# EAGLE design sch+®ma_carte_alim_v1_1 (EAGLE 6.5.0)

## Sheet 1 of 2
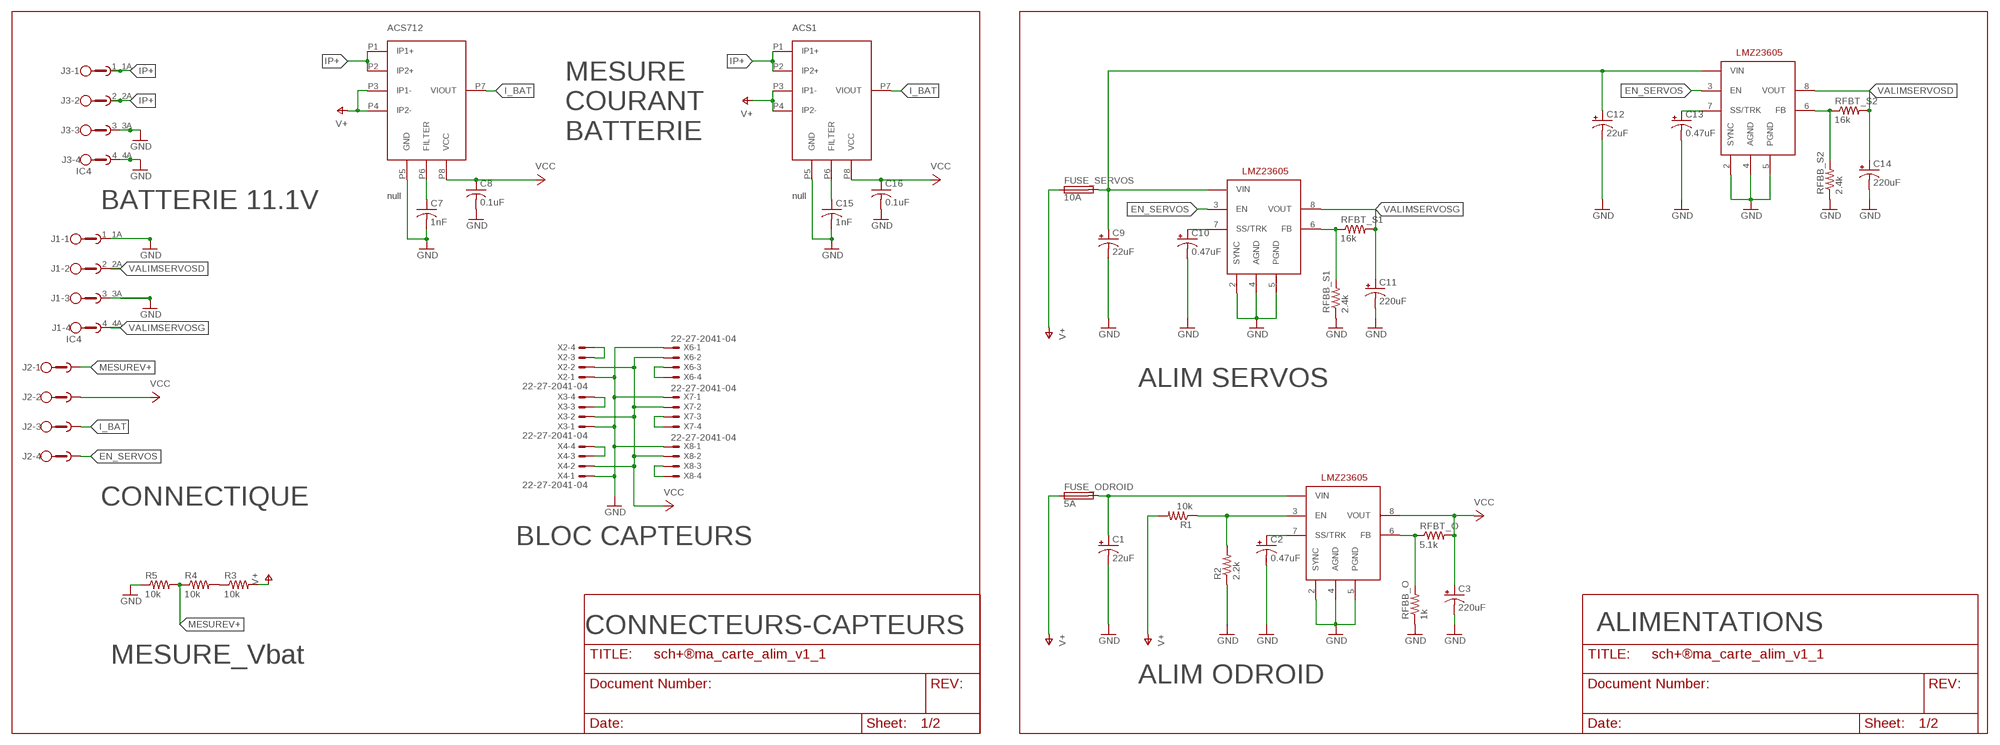
[diagram p0: schematic, sheet 1]

### Parts
ACS1  null  ACS712  [ACS712]
ACS712  null  ACS712  [ACS712]
ALIM_ODROID  LMZ23605  [LMZ23605]
ALIM_SERVOS1  LMZ23605  [LMZ23605]
ALIM_SERVOS2  LMZ23605  [LMZ23605]
C1  22uF  CPOL-USE2.5-6  [E2,5-6]
C2  0.47uF  CPOL-USE2-5  [E2-5]
C3  220uF  CPOL-USE3.5-8  [E3,5-8]
C7  1nF  C-USC0805  [C0805]
C8  0.1uF  C-USC0805  [C0805]
C9  22uF  CPOL-USE2.5-6  [E2,5-6]
C10  0.47uF  CPOL-USE2-5  [E2-5]
C11  220uF  CPOL-USE3.5-8  [E3,5-8]
C12  22uF  CPOL-USE2.5-6  [E2,5-6]
C13  0.47uF  CPOL-USE2-5  [E2-5]
C14  220uF  CPOL-USE3.5-8  [E3,5-8]
C15  1nF  C-USC0805  [C0805]
C16  0.1uF  C-USC0805  [C0805]
FUSE_ODROID  5A  SH22,5  [SH22,5]
FUSE_SERVOS  10A  SH22,5  [SH22,5]
J1  IC4  [IC4]
J2  MC1.5/4-G-3.81  [MC1.5/4-G-3.81]
J3  IC4  [IC4]
R1  10k  R-US_R0805  [R0805]
R2  2.2k  R-US_R0805  [R0805]
R3  10k  R-US_M0805  [M0805]
R4  10k  R-US_M0805  [M0805]
R5  10k  R-US_M0805  [M0805]
RFBB_O  1k  R-US_R0805  [R0805]
RFBB_S1  2.4k  R-US_R0805  [R0805]
RFBB_S2  2.4k  R-US_R0805  [R0805]
RFBT_O  5.1k  R-US_R0805  [R0805]
RFBT_S1  16k  R-US_R0805  [R0805]
RFBT_S2  16k  R-US_R0805  [R0805]
X2  22-27-2041-04  [6410-04]
X3  22-27-2041-04  [6410-04]
X4  22-27-2041-04  [6410-04]
X6  22-27-2041-04  [6410-04]
X7  22-27-2041-04  [6410-04]
X8  22-27-2041-04  [6410-04]

### Nets
EN_SERVOS [4A_ODROI]: ALIM_SERVOS1.3(EN) ALIM_SERVOS2.3(EN) J2.4
GND [1A_CAPTEURS+fil_fable_courant]: ACS1.P5(GND) ACS712.P5(GND) ALIM_ODROID.2(SYNC) ALIM_ODROID.4(AGND) ALIM_ODROID.5(PGND) ALIM_SERVOS1.2(SYNC) ALIM_SERVOS1.4(AGND) ALIM_SERVOS1.5(PGND) ALIM_SERVOS2.2(SYNC) ALIM_SERVOS2.4(AGND) ALIM_SERVOS2.5(PGND) C1.- C2.- C3.- C7.2 C8.2 C9.- C10.- C11.- C12.- C13.- C14.- C15.2 C16.2 J1.1 J1.1A J1.3 J1.3A J3.3 J3.3A J3.4 J3.4A R2.1 R5.1 RFBB_O.1 RFBB_S1.1 RFBB_S2.1 X2.1 X3.1 X4.1 X6.1 X7.1 X8.1
I_BAT [1A_CAPTEURS+fil_fable_courant]: ACS1.P7(VIOUT) ACS712.P7(VIOUT) J2.3
IP+: ACS1.P1(IP1+) ACS1.P2(IP2+) ACS712.P1(IP1+) ACS712.P2(IP2+) J3.1 J3.1A J3.2 J3.2A
MESUREV+ [1A_CAPTEURS+fil_fable_courant]: J2.1 R4.1 R5.2
N$1: X6.3 X6.4
N$2 [4A_ODROI]: ALIM_ODROID.7(SS/TRK) C2.+
N$4 [1A_CAPTEURS+fil_fable_courant]: ALIM_ODROID.6(FB) RFBB_O.2 RFBT_O.1
N$5 [1A_CAPTEURS+fil_fable_courant]: R3.1 R4.2
N$6 [1A_CAPTEURS+fil_fable_courant]: ACS1.P6(FILTER) C15.1
N$7: X7.3 X7.4
N$8 [1A_CAPTEURS+fil_fable_courant]: ALIM_ODROID.3(EN) R1.1 R2.2
N$9: X8.3 X8.4
N$11 [1A_CAPTEURS+fil_fable_courant]: ACS712.P6(FILTER) C7.1
N$19 [4A_ODROI]: ALIM_SERVOS1.7(SS/TRK) C10.+
N$22 [1A_CAPTEURS+fil_fable_courant]: X2.3 X2.4
N$25 [1A_CAPTEURS+fil_fable_courant]: X3.3 X3.4
N$26 [1A_CAPTEURS+fil_fable_courant]: X4.3 X4.4
N$28 [1A_CAPTEURS+fil_fable_courant]: ALIM_SERVOS1.6(FB) RFBB_S1.2 RFBT_S1.1
N$31 [4A_ODROI]: ALIM_SERVOS2.7(SS/TRK) C13.+
N$32 [1A_CAPTEURS+fil_fable_courant]: ALIM_SERVOS2.6(FB) RFBB_S2.2 RFBT_S2.1
V+ [1A_CAPTEURS+fil_fable_courant]: ACS1.P3(IP1-) ACS1.P4(IP2-) ACS712.P3(IP1-) ACS712.P4(IP2-) FUSE_ODROID.1 FUSE_SERVOS.1 R1.2 R3.2
VALIMSERVOSD [10A_SERVOS]: ALIM_SERVOS2.8(VOUT) C14.+ J1.2 J1.2A RFBT_S2.2
VALIMSERVOSG [10A_SERVOS]: ALIM_SERVOS1.8(VOUT) C11.+ J1.4 J1.4A RFBT_S1.2
VCC [4A_ODROI]: ACS1.P8(VCC) ACS712.P8(VCC) ALIM_ODROID.8(VOUT) C3.+ C8.1 C16.1 J2.2 RFBT_O.2 X2.2 X3.2 X4.2 X6.2 X7.2 X8.2
VIN [10A_SERVOS]: ALIM_SERVOS1.1(VIN) ALIM_SERVOS2.1(VIN) C9.+ C12.+ FUSE_SERVOS.2
VINO [5A_LMZ_SERVOS]: ALIM_ODROID.1(VIN) C1.+ FUSE_ODROID.2

### Notes on the sheet
- MESURE
  COURANT
  BATTERIE
- BATTERIE 11.1V
- ALIM SERVOS
- CONNECTIQUE
- BLOC CAPTEURS
- CONNECTEURS-CAPTEURS | ALIMENTATIONS
- MESURE_Vbat
- ALIM ODROID

## Sheet 2 of 2

## Library data of the parts
ACS1 ACS712 = ACS712:ACS712: http://www.allegromicro.com/~/media/Files/Datasheets/ACS712-Datasheet.ashx
ALIM_ODROID ALIM_SERVOS1 ALIM_SERVOS2 = LMZ23605:LMZ23605: LMZ23605 5A SIMPLE SWITCHER® Power Module with 36V Maximum Input Voltage
C1-C3 C9-C14 = rcl:CPOL-US: POLARIZED CAPACITOR, American symbol
C7 C8 C15 C16 = rcl:C-US: CAPACITOR, American symbol
FUSE_ODROID FUSE_SERVOS = fuse:SH22,5: FUSE HOLDER grid 22,5 mm, OGN0031 8201, Schurter (Buerklin); MF: SCHURTER; MPN: 0031.8201; OC_FARNELL: 1162740; OC_NEWARK: 96F8317
J1 J3 = con-phoenix-508:IC4: PHOENIX; OC_FARNELL: unknown; OC_NEWARK: unknown
J2 = Connecteurs_Introlab:MC1.5/4-G-3.81: Digi-Key Part Number 277-1208-ND Manufacturer Part Number 1803293 Description CONN HEADER RT ANG 4POS 3.81MM Goes with Digi-Key Part Number 277-1163-ND Manufacturer Part Number 1803594 Description CONN TERMBLOCK PLUG 4POS 3.81MM
R1-R5 RFBB_O RFBB_S1 RFBB_S2 RFBT_O RFBT_S1 RFBT_S2 = resistor:R-US_: RESISTOR, American symbol
X2-X4 X6-X8 = con-molex:22-?-04: CONNECTOR wire to board 2.54 mm (.1 inch) pitch header; OC_FARNELL: unknown; OC_NEWARK: unknown

## Net classes
0 18A_SORTIE_BATTERIE: width 10.16 mm, clearance 0.008 mm
1 10A_SERVOS: width 5.08 mm, clearance 0.008 mm
2 5A_LMZ_SERVOS: width 1.524 mm
3 4A_ODROI: width 1.524 mm
4 1A_CAPTEURS+fil_fable_courant: width 0.508 mm

## Board
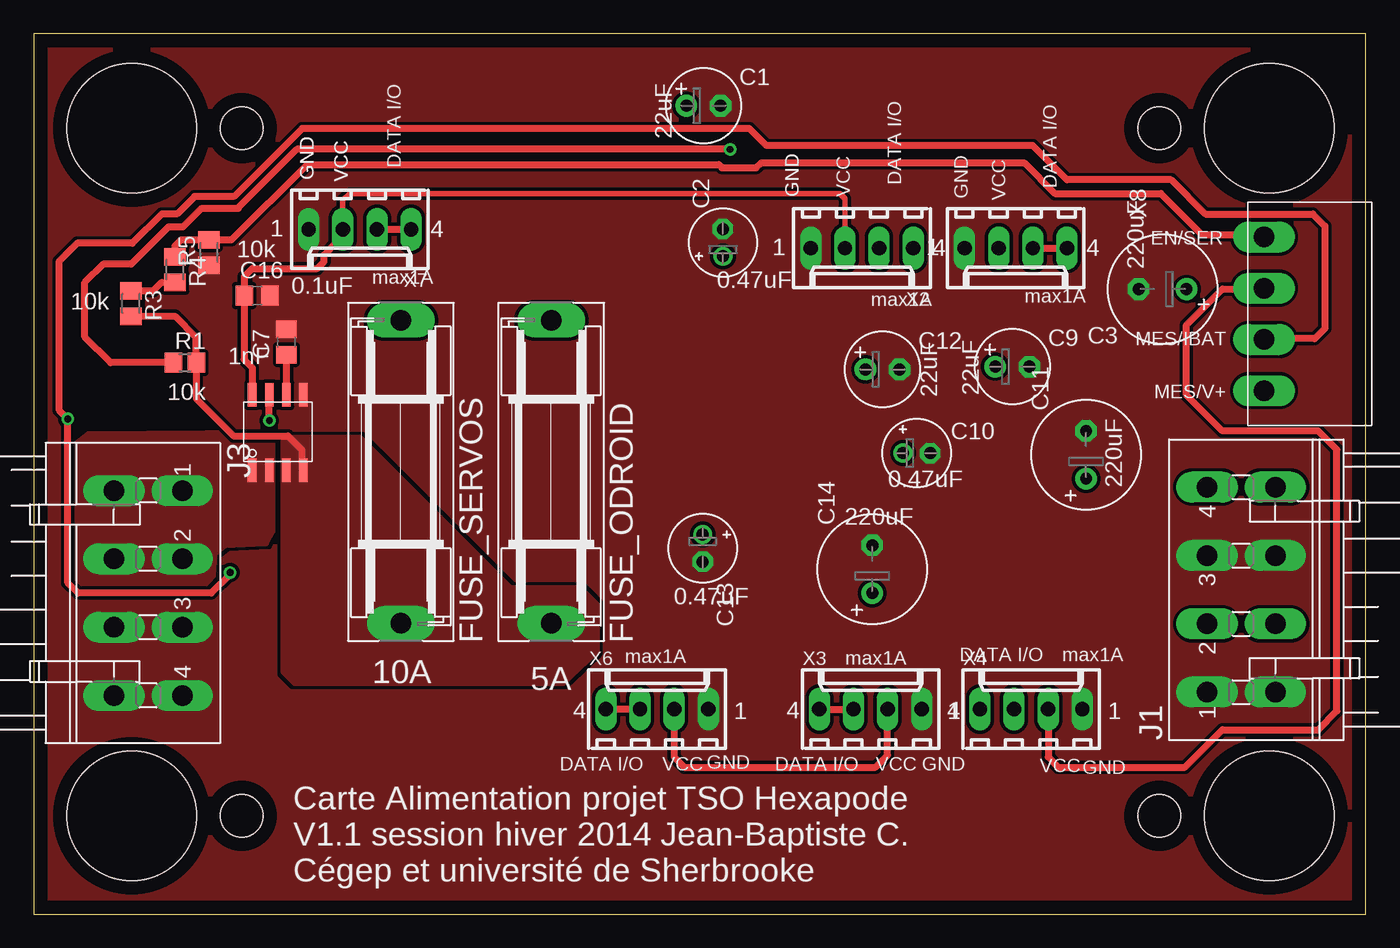
[diagram p1: board, top side]
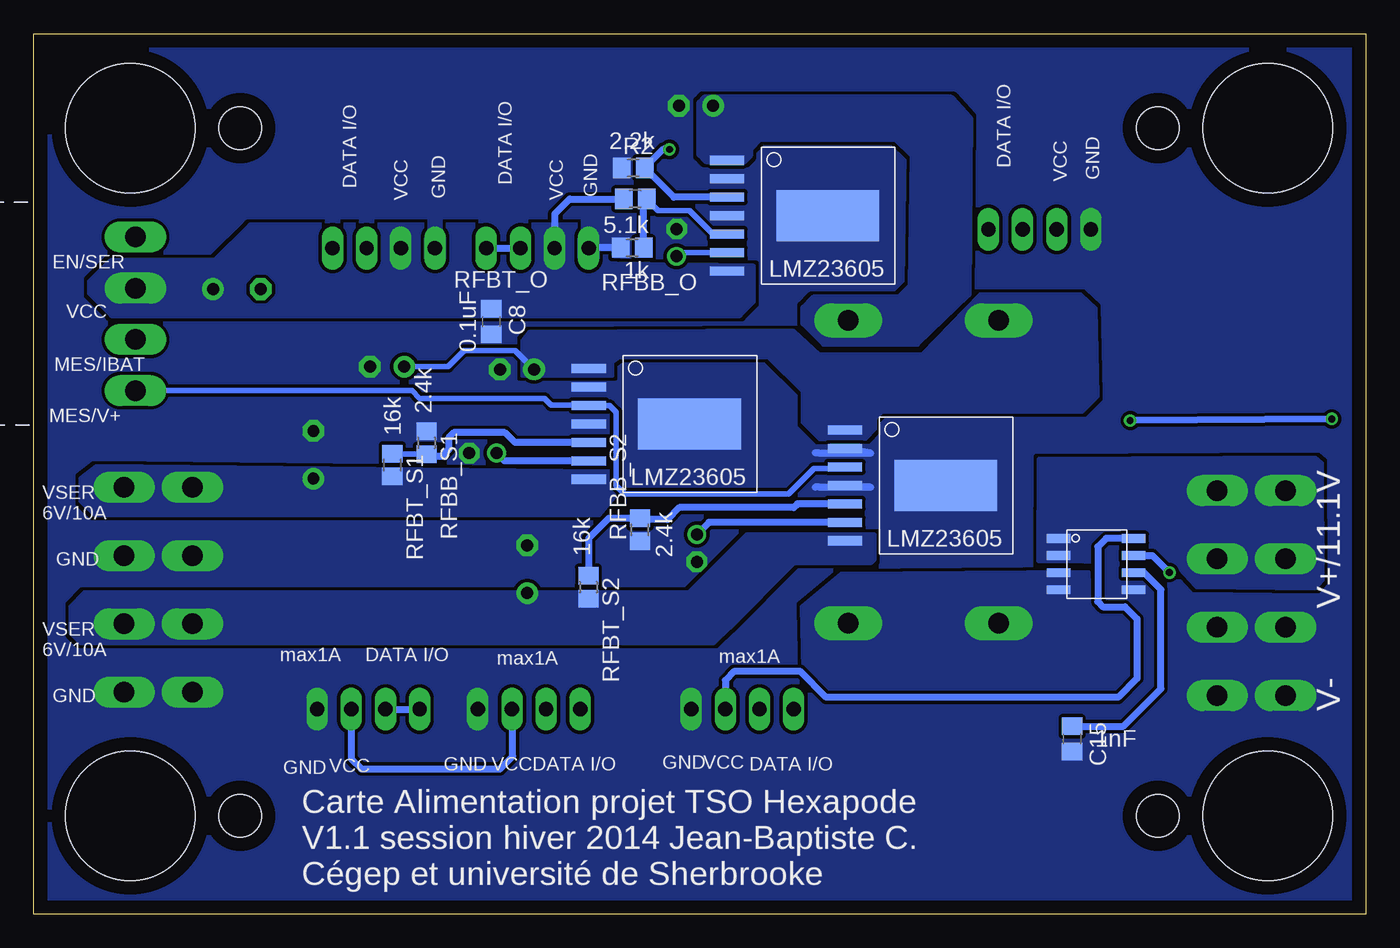
[diagram p2: board, bottom side, seen from below]

Size 99.06 x 65.48 mm. Coordinates in mm from the lower left corner, seen from the top.
Outline: 0,0 99.06,0 99.06,65.48 0,65.48 0,0
Copper layers (1*16): Top 0.035mm / dielectric 1.5mm / Bottom 0.035mm
Design rules "default *": minimum track width 10mil, minimum drill 20mil, track to track 10mil, track to pad 10mil, pad to pad 10mil, via to via 10mil, smd to smd 8mil, copper to edge 40mil, drill to drill 10mil, minimum pad ring 10mil, minimum via ring 8mil, stop-mask expansion 4mil, vias tented up to drill 0mil, thermal gap 0mil
Holes 9.65 mm at 7.3,58.46 7.3,7.3 91.87,58.46 91.87,7.3
Holes 3.17 mm at 15.46,58.46 15.46,7.3 83.72,58.46 83.72,7.3

### Footprints (pad centres in the part's own frame; a part is rotated, then mirrored left to right if it is on the bottom)
ACS712 = smd 0.65 x 1.75: P1 0,0; P2 1.27,0; P3 2.54,0; P4 3.81,0; P5 3.81,5.6; P6 2.54,5.6; P7 1.27,5.6; P8 0,5.6
LMZ23605 = smd 2.54 x 0.686: 1 4.445,11.227; 2 4.445,9.855; 3 4.445,8.484; 4 4.445,7.112; 6 4.445,5.74; 7 4.445,4.369; 8 4.445,2.997 | smd 7.62 x 3.81: 5 11.938,7.112
E2,5-6 = drill 0.889 pad 1.6: + -1.27,0 | drill 0.889 pad 1.6 octagon: - 1.27,0
E2-5 = drill 0.889 pad 1.27: + -1.016,0 | drill 0.889 pad 1.524 octagon: - 1.016,0
E3,5-8 = drill 0.889 pad 1.6: + -1.778,0 | drill 0.889 pad 1.6 octagon: - 1.778,0
C0805 = smd 1.3 x 1.5: 1 -0.95,0; 2 0.95,0
SH22,5 = drill 1.524 pad 2.54 long: 1 -11.252,0; 2 11.252,0
IC4 = drill 1.524 long: 1 -7.62,2.54; 1A -7.62,-2.54; 2 -2.54,2.54; 2A -2.54,-2.54; 3 2.54,2.54; 3A 2.54,-2.54; 4 7.62,2.54; 4A 7.62,-2.54
MC1.5/4-G-3.81 = drill 1.524 pad 2.184 long: 1 2.6,1.2; 2 6.41,1.2; 3 10.22,1.2; 4 14.03,1.2
R0805 = smd 1.3 x 1.5: 1 -0.85,0; 2 0.85,0
M0805 = smd 1.3 x 1.6: 1 -0.95,0; 2 0.95,0
6410-04 = drill 1.067 long: 1 3.81,0; 2 1.27,0; 3 -1.27,0; 4 -3.81,0

### Placement (x,y rotation side)
ACS1  22.86,27.94 270 bottom
ACS712  16.26,33.02 0 top
ALIM_ODROID  51.94,44.83 0 bottom
ALIM_SERVOS1  62.23,29.34 0 bottom
ALIM_SERVOS2  43.18,24.77 0 bottom
C1  49.81,60.12 0 top
C2  51.26,49.94 90 top
C3  83.95,46.48 180 top
C7  18.8,42.55 90 top
C8  65.02,44.07 270 bottom
C9  72.77,40.72 0 top
C10  65.66,34.29 0 top
C11  78.26,34.16 90 top
C12  63.12,40.51 0 top
C13  49.75,27.21 270 top
C14  62.36,25.65 90 top
C15  21.84,13.03 270 bottom
C16  16.61,46 0 top
FUSE_ODROID  38.48,32.89 90 top
FUSE_SERVOS  27.3,32.89 90 top
J1  89.79,24.13 90 top
J2  90.3,52.96 270 top
J3  8.51,23.88 270 top
R1  11.25,41.01 0 top
R2  54.48,55.5 0 bottom
R3  7.24,45.42 270 top
R4  10.52,47.93 270 top
R5  13.03,49.2 90 top
RFBB_O  54.56,49.56 0 bottom
RFBB_S1  69.85,35.05 270 bottom
RFBB_S2  53.98,28.57 90 bottom
RFBT_O  54.33,53.19 180 bottom
RFBT_S1  72.39,33.4 270 bottom
RFBT_S2  57.81,24.31 270 bottom
X2  61.59,49.53 180 top
X3  62.23,15.24 0 top
X4  74.17,15.24 0 top
X6  46.35,15.24 0 top
X7  24.26,50.93 180 top
X8  73.03,49.53 180 top

### Tracks (layer width: path | path; a pad name or v marks a point on that pad's centre or on a via)
EN_SERVOS
  Bottom 0.406: J2.4 70.93,38.93 70.36,38.35 61.09,38.35 60.58,37.85 57.81,37.85 ALIM_SERVOS1.3 56.24,37.82 55.75,37.34 55.75,31.88 55.12,31.24 42.93,31.24 41.02,33.15 38.84,33.15 ALIM_SERVOS2.3
GND
  Bottom 0.508: ALIM_SERVOS2.4 36.83,31.75 40.64,31.75 40.96,31.75 | ALIM_SERVOS2.2 36.83,34.29 40.64,34.29 40.94,34.29 | RFBB_O.1 57.76,49.55 X2.1
  pour Top (rank 2, no thermals): -1.91,67.31 -2.54,-3.3 100.97,-2.54 100.97,67.31
  pour Bottom (rank 2, no thermals): 101.6,67.94 101.6,-3.17 -2.44,-3.4 -2.57,67.89
I_BAT  (via drill 0.51)
  Top 0.508: v17.53,36.7 ACS712.P7 | J2.3 91.56,42.8 95.25,42.8 96.01,43.56 96.01,51.18 95.12,52.07 87.12,52.07 84.58,54.61 76.83,54.61 74.3,57.15 54.48,57.15 53.21,58.42 19.96,58.42 14.91,53.37 11.96,53.37 10.67,52.07 9.53,52.07 7.34,49.89 3.23,49.89 1.91,48.56 1.91,37.47 v2.54,36.83 2.54,24.64 3.3,23.88 13.21,23.88 14.61,25.27 v14.61,25.4
  Bottom 0.508: v2.54,36.83 v17.53,36.7 | ACS1.P7 15.88,26.67 v14.61,25.4
IP+
  pour Top (isolate 0.254, no thermals): 3.05,34.92 4.06,35.69 17.12,35.81 17.78,35.51 17.78,28.45 17.27,27.56 14.22,27.43 13.46,26.8 13.34,25.15 12.62,24.33 2.79,24.33
  pour Bottom (no thermals): 14.25,26.19 24.31,26.31 24.28,33.81 3.78,33.93 3.3,33.53 3.28,24.84 3.81,24.26 12.57,24.38
MESUREV+
  Top 0.508: R4.1 10.52,49.71 10.96,50.15 R5.2 14.72,50.15 20.32,55.75 50.93,55.75 51.18,55.5 53.72,55.5 54.1,55.88 73.66,55.88 75.95,53.59 83.82,53.59 86.87,50.55 91.31,50.55 J2.1
N$1
  Top 0.508: X6.3 X6.4
N$2
  Bottom 0.406: ALIM_ODROID.7 50.88,49.2 C2.+
N$4
  Bottom 0.406: ALIM_ODROID.6 48.54,50.57 50.29,52.32 52.62,52.32 RFBT_O.1
  Bottom 0.508: RFBB_O.2 53.71,52.96 RFBT_O.1
N$5
  Top 0.508: R3.1 8.6,46.35 8.89,46.35 9.53,46.99 R4.2
N$6
  Bottom 0.508: C15.1 18.02,13.98 15.24,16.76 15.24,24.13 16.51,25.4 ACS1.P6
N$7
  Top 0.508: X7.3 X7.4
N$8  (via drill 0.51)
  Top 0.508: v51.79,56.87 19.56,56.87 15.21,52.53 15.21,52.5 12.5,52.5 11.1,51.1 10.01,51.1 7.24,48.34 5.16,48.34 3.81,46.99 3.81,42.93 5.73,41.01 R1.1
  Bottom 0.508: 52.22,56.87 v51.79,56.87 52.26,56.87 R2.2 51.45,53.31 ALIM_ODROID.3
N$9
  Top 0.508: X8.3 X8.4
N$11
  Top 0.508: ACS712.P6 C7.1
N$19
  Bottom 0.508: ALIM_SERVOS1.7 64.06,33.71 C10.+
N$22
  Bottom 0.508: X2.4 X2.3
N$25
  Top 0.508: X3.4 X3.3
N$26
  Bottom 0.508: X4.3 X4.4
N$28
  Bottom 0.406: RFBB_S1.2 72.34,34.2 RFBT_S1.1
  Bottom 0.508: ALIM_SERVOS1.6 63.27,35.08 64.01,35.81 67.82,35.81 68.2,35.43 68.2,34.54 68.71,34.04 69.68,34.04 RFBB_S1.2
N$31
  Bottom 0.508: ALIM_SERVOS2.7 48.84,29.13 C13.+
N$32
  Bottom 0.508: ALIM_SERVOS2.6 42.27,30.5 42.55,30.23 51.05,30.23 51.94,29.34 53.89,29.34 RFBB_S2.2 56.3,29.43 57.78,27.94 57.78,25.18 RFBT_S2.1
V+
  Top 0.508: ACS712.P4 19.94,33.15 19.94,34.54 18.92,35.56 14.86,35.56 12.09,38.33 R1.2 12.06,41.05 12.06,42.93 10.53,44.47 R3.2
  pour Top (no thermals): 41.78,19.43 39.37,17.14 19.43,17.14 18.54,18.03 18.54,35.43 24.26,35.43 35.43,24.26 40.64,24.26 41.91,22.99 41.91,19.56
  pour Bottom: 40.64,16.76 18.67,16.51 17.4,17.4 17.4,21.97 18.03,22.61 20.57,22.76 20.68,25.4 38.99,25.27 41.91,22.86 41.78,18.16
VALIMSERVOSD
  pour Bottom: 40.26,27.81 37.08,27.56 37.34,27.81
  pour Bottom (no thermals): 36.58,28.19 36.58,26.42 36.83,26.16 42.55,26.16 47.37,21.34 48.51,20.19 95.5,20.19 96.27,20.95 96.27,22.86 95.25,23.88 50.29,23.88 45.97,28.19
VALIMSERVOSG
  pour Bottom (no thermals): 55.75,32.38 55.75,31.24 57.02,29.72 94.49,29.72 95.5,30.73 95.5,32.38 94.36,33.27 56.26,32.89
VCC
  Top 0.406: X7.2 22.99,53.09 23.5,53.59 59.94,53.59 60.33,53.21 X2.2
  Top 0.508: 22.86,50.8 X7.2 22.61,50.55 22.61,50.04 21.59,49.02 21.59,48.51 21.08,48.01 16.26,48.01 15.66,47.41 C16.1 15.65,45.98 15.65,41.25 16.26,40.64 ACS712.P8 | X6.2 47.62,11.68 48.39,10.92 62.61,10.92 63.5,11.81 X3.2 | X4.2 75.44,11.68 76.2,10.92 85.6,10.92 88.39,13.72 95.5,13.72 96.9,15.11 96.9,34.54 95.5,35.94 88.39,35.94 85.72,38.61 85.72,43.81 88.39,46.48 91.43,46.48 J2.2
  Bottom 0.508: 22.86,50.8 X7.2 | X2.2 60.33,52.07 59.21,53.19 RFBT_O.2 | X4.2 75.44,11.56 74.68,10.79 64.39,10.79 63.44,11.75 63.44,15.18 X3.2 | ACS1.P8 19.3,27.94 19.94,27.3 19.94,23.24 19.56,22.86 17.91,22.86 17.02,21.97 17.02,17.53 18.41,16.13 40.13,16.13 42.04,18.03 46.99,18.03 47.62,17.4 X6.2
  pour Bottom (no thermals): 45.59,48.13 55.75,48.26 58.55,51.18 82.93,51.18 85.6,48.51 93.34,48.51 94.87,46.99 94.87,46.23 93.22,44.58 46.61,44.58 45.59,45.59
VIN
  Bottom 0.406: C9.+ 68.25,40.72 67.06,41.91 63.25,41.91 C12.+
  pour Bottom (no thermals): 21.21,46.1 28.7,46.1 33.02,41.66 40.64,41.66 42.55,43.43 62.23,43.31 62.74,42.67 62.74,40.01 56.01,40.01 56.01,41.02 55.5,41.4 44.45,41.4 41.91,38.86 41.91,36.58 40.64,35.31 37.21,35.31 36.45,36.07 36.45,36.83 35.94,37.34 21.08,37.34 19.94,38.48 20.07,45.09
VINO
  pour Bottom (no thermals): 29.59,46.1 33.4,42.42 40.26,42.42 41.78,43.94 41.78,45.09 41.02,45.85 34.67,45.85 33.78,46.74 33.66,56.39 34.92,57.66 45.09,57.66 45.85,56.9 45.85,56.39 46.23,56.01 49.02,56.01 49.53,56.52 49.53,60.33 49.15,60.71 30.86,60.71 29.46,59.18

### Text on the board
tPlace: DATA I/O | DATA I/O | DATA I/O | GND | GND | VCC | VCC | GND | GND | VCC | GND | VCC | EN/SER | max1A | max1A | max1A | MES/IBAT | MES/V+ | max1A | max1A | DATA I/O | max1A | DATA I/O | VCC | GND | DATA I/O | VCC | GND | VCC | GND | Carte Alimentation projet TSO Hexapode / V1.1 session hiver 2014 Jean-Baptiste C. / Cégep et université de Sherbrooke
bPlace: DATA I/O | DATA I/O | DATA I/O | VCC | GND | VCC | GND | GND | VCC | EN/SER | VCC | MES/IBAT | MES/V+ | VSER / 6V/10A | GND | V+/11.1V | max1A | max1A | DATA I/O | max1A | VSER / 6V/10A | GND | V- | DATA I/O | VCC | GND | DATA I/O | VCC | GND | VCC | GND | Carte Alimentation projet TSO Hexapode / V1.1 session hiver 2014 Jean-Baptiste C. / Cégep et université de Sherbrooke